# EAGLE design FioSaber Prototype B (EAGLE 6.5.0)
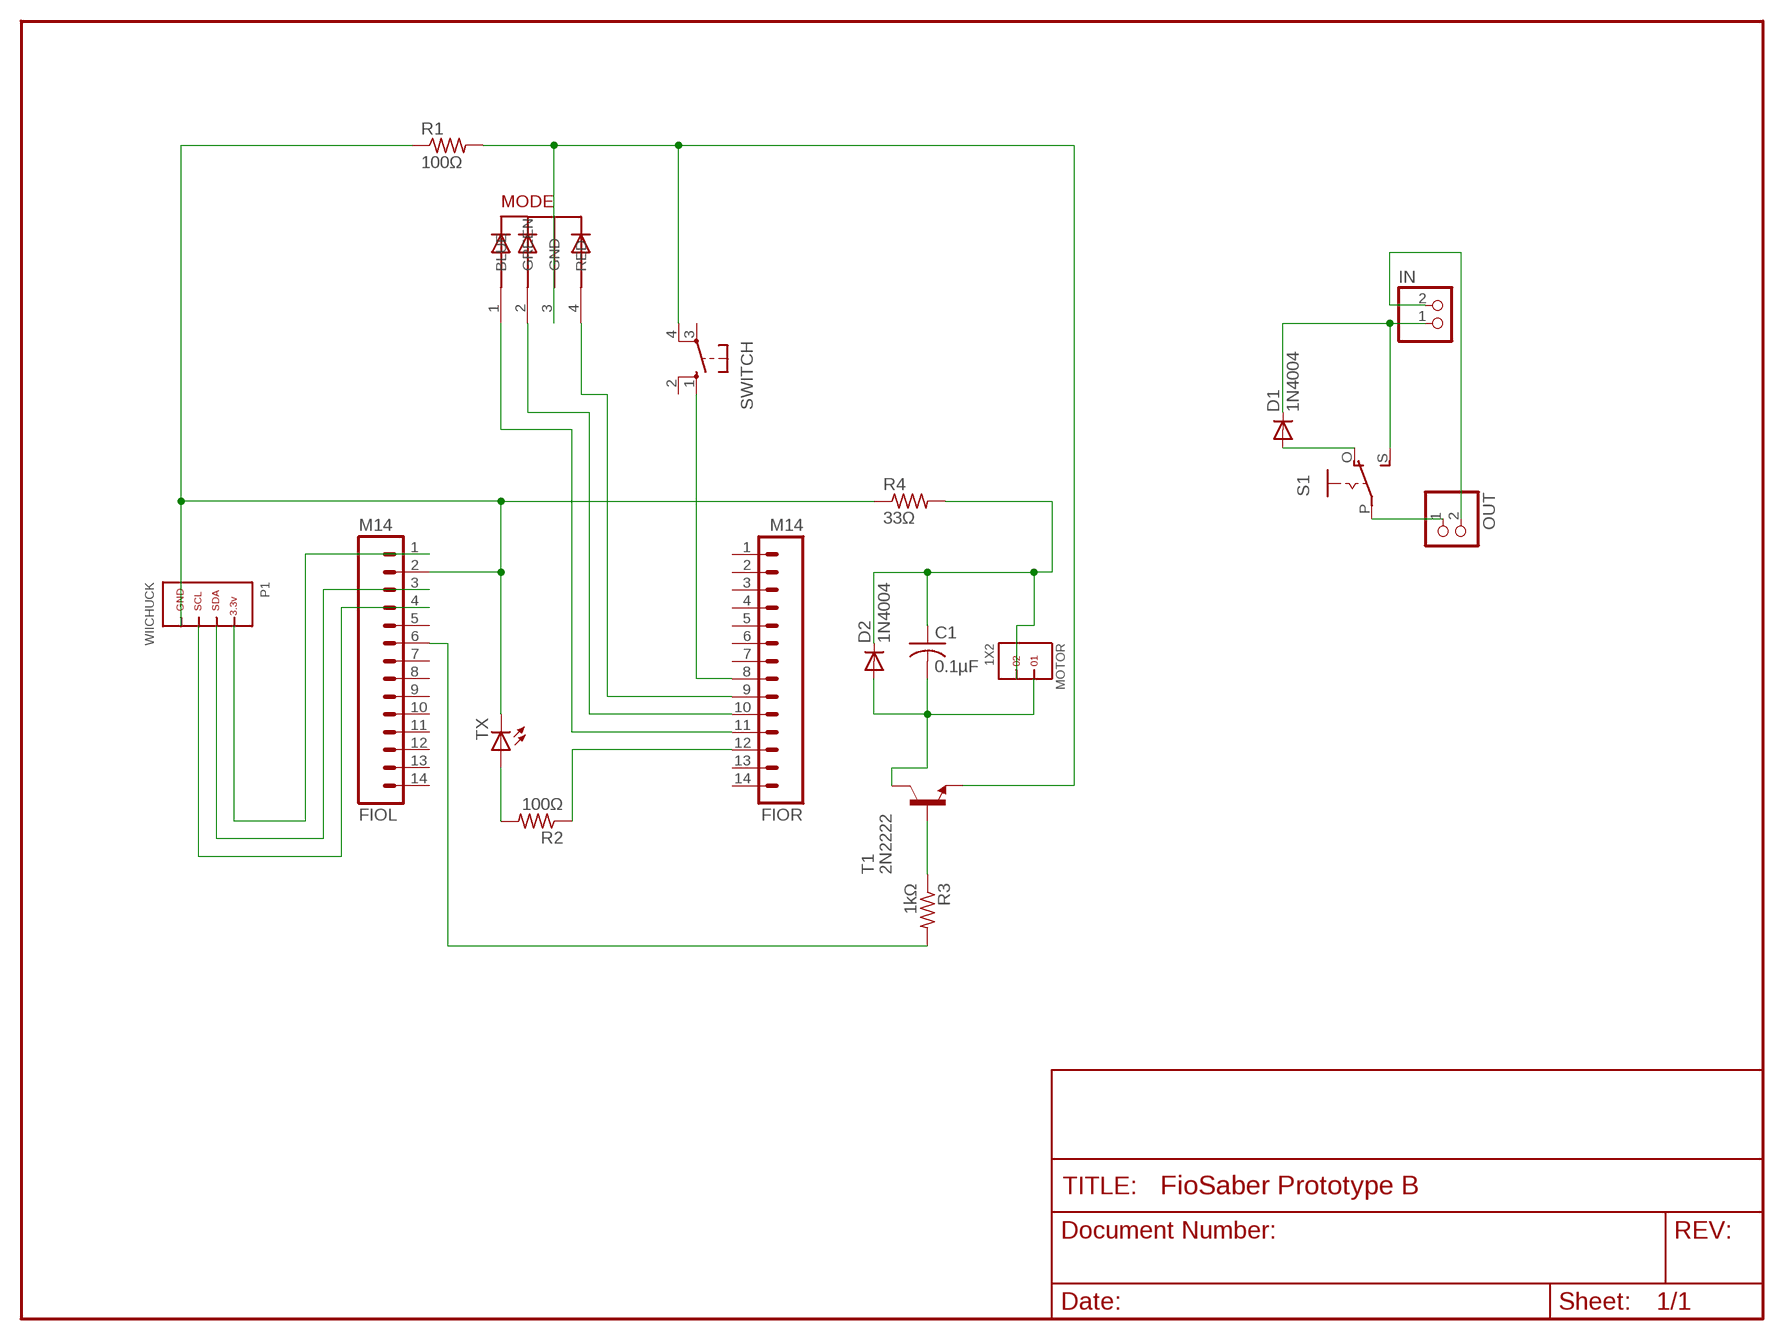
[diagram p0: schematic, sheet 1]

## Parts
C1  0.1µF  C-US025-025X050  [C025-025X050]
D1  1N4004  [DO41-10]
D2  1N4004  [DO41-10]
FIOL  M14  [1X14]
FIOR  M14  [1X14]
IN  JST_2PIN-SMT-RA  [JST-PH-2-SMT-RA]
MODE  5MMRGBLED  [LED5MMRGB]
MOTOR  1X2  [1X2]
OUT  JST_2PIN-SMT-RA  [JST-PH-2-SMT-RA]
P1  WIICHUCK  [MEMOREX_RECEIVER]
R1  100Ω  R-US_0207/7  [0207/7]
R2  100Ω  R-US_0207/7  [0207/7]
R3  1kΩ  R-US_0207/7  [0207/7]
R4  33Ω  R-US_0207/7  [0207/7]
S1  EG1218S  [EG1218]
SWITCH  10-XX  [B3F-10XX]
T1  2N2222  [TO92-EBC-OVAL]
TX  LED3MM  [LED3MM]

## Nets
N$1: FIOL.1 P1.PWR
N$2: D1.C IN.1 S1.S
N$3: FIOL.3 P1.SDA
N$4: FIOL.4 P1.SCL
N$5: D1.A S1.O
N$6: FIOR.11 MODE.1(BLUE)
N$7: FIOR.10 MODE.2(GREEN)
N$8: FIOR.9 MODE.4(RED)
N$9: FIOL.2 P1.GND R1.1 R4.1 TX.K(C)
N$10: OUT.1 S1.P
N$11: IN.2 OUT.2
N$13: MODE.3(GND) R1.2 SWITCH.4(P1) T1.E
N$14: FIOR.8 SWITCH.1(S)
N$16: FIOL.6 R3.2
N$17: FIOR.12 R2.1
N$18: R3.1 T1.B
N$19: C1.2 D2.A MOTOR.1 T1.C
N$20: C1.1 D2.C MOTOR.2 R4.2
N$25: R2.2 TX.A
Unconnected: FIOL.5 FIOL.7 FIOL.8 FIOL.9 FIOL.10 FIOL.11 FIOL.12 FIOL.13 FIOL.14 FIOR.1 FIOR.2 FIOR.3 FIOR.4 FIOR.5 FIOR.6 FIOR.7 FIOR.13 FIOR.14 SWITCH.2(S1) SWITCH.3(P)

## Library data of the parts
C1 = rcl:C-US: CAPACITOR, American symbol
D1 D2 = adafruit:1N4004: DIODE General purpose 1N400x type rectifier (With bigger pads) http://www.ladyada.net/library/pcb/eaglelibrary.html
FIOL FIOR = SparkFun:M14: Header 14 Standard 14-pin 0.1" header. Use with straight break away headers (SKU : PRT-00116), right angle break away headers (PRT-00553), swiss pins (PRT-00743), machine pins (PRT-00117), and female headers (PRT-00115).
IN OUT = adafruit:JST_2PIN: JST 2-Pin Connectors of various flavors SMT-RA (S2B-PH-SM4) 4UConnector #17311 SMT (B2B-PH-SM4) THM-RA (S2B-PH) THM (B2B-PH)
MODE = adafruit:5MMRGBLED
MOTOR = headers(.1in):1X2
P1 = nintendo:WIICHUCK
R1-R4 = adafruit:R-US_: RESISTOR, American symbol
S1 = adafruit:EG1218: SLIDING SWITCH 0.1" spacing through hole, vertical SPDT slide switch http://www.ladyada.net/library/pcb/eaglelibrary.html
SWITCH = switch-omron:10-XX: OMRON SWITCH; MPN: B3F-1000; OC_FARNELL: 176432; OC_NEWARK: 36M3542
T1 = adafruit:2N2222: NPN TRANSISTOR Big oval pads
TX = adafruit:LED: LED OSRAM: - CHIPLED LG R971, LG N971, LY N971, LG Q971, LY Q971, LO R971, LY R971 LH N974, LH R974 LS Q976, LO Q976, LY Q976 LO Q996 - Hyper CHIPLED LW Q18S LB Q993, LB Q99A, LB R99A - SideLED LS A670, LO A670, LY A670, LG A670, LP A670 LB A673, LV A673, LT A673, LW A673 LH A674 LY A675 LS A676, LA A676, LO A676, LY A676, LW A676 LS A679, LY A679, LG A679 - Hyper Micro SIDELED® LS Y876, LA Y876, LO Y876, LY Y876 LT Y87S - SmartLED LW L88C, LW L88S LB L89C, LB L89S, LG L890 LS L89K, LO L89K, LY L89K LS L896, LA L896, LO L896, LY L896 - TOPLED LS T670, LO T670, LY T670, LG T670, LP T670 LSG T670, LSP T670, LSY T670, LOP T670, LYG T670 LG T671, LOG T671, LSG T671 LB T673, LV T673, LT T673, LW T673 LH T674 LS T676, LA T676, LO T676, LY T676, LB T676, LH T676, LSB T676, LW T676 LB T67C, LV T67C, LT T67C, LS T67K, LO T67K, LY T67K, LW E67C LS E67B, LA E67B, LO E67B, LY E67B, LB E67C, LV E67C, LT E67C LW T67C LS T679, LY T679, LG T679 LS T770, LO T770, LY T770, LG T770, LP T770 LB T773, LV T773, LT T773, LW T773 LH T774 LS E675, LA E675, LY E675, LS T675 LS T776, LA T776, LO T776, LY T776, LB T776 LHGB T686 LT T68C, LB T68C - Hyper Mini TOPLED® LB M676 - Mini TOPLED Santana® LG M470 LS M47K, LO M47K, LY M47K Source: http://www.osram.convergy.de/

## Net classes
0 Default: width 0.203 mm, clearance 0.205 mm
2 LEDPower: width 0.203 mm
3 ButtonSignal: width 0.203 mm

## Board
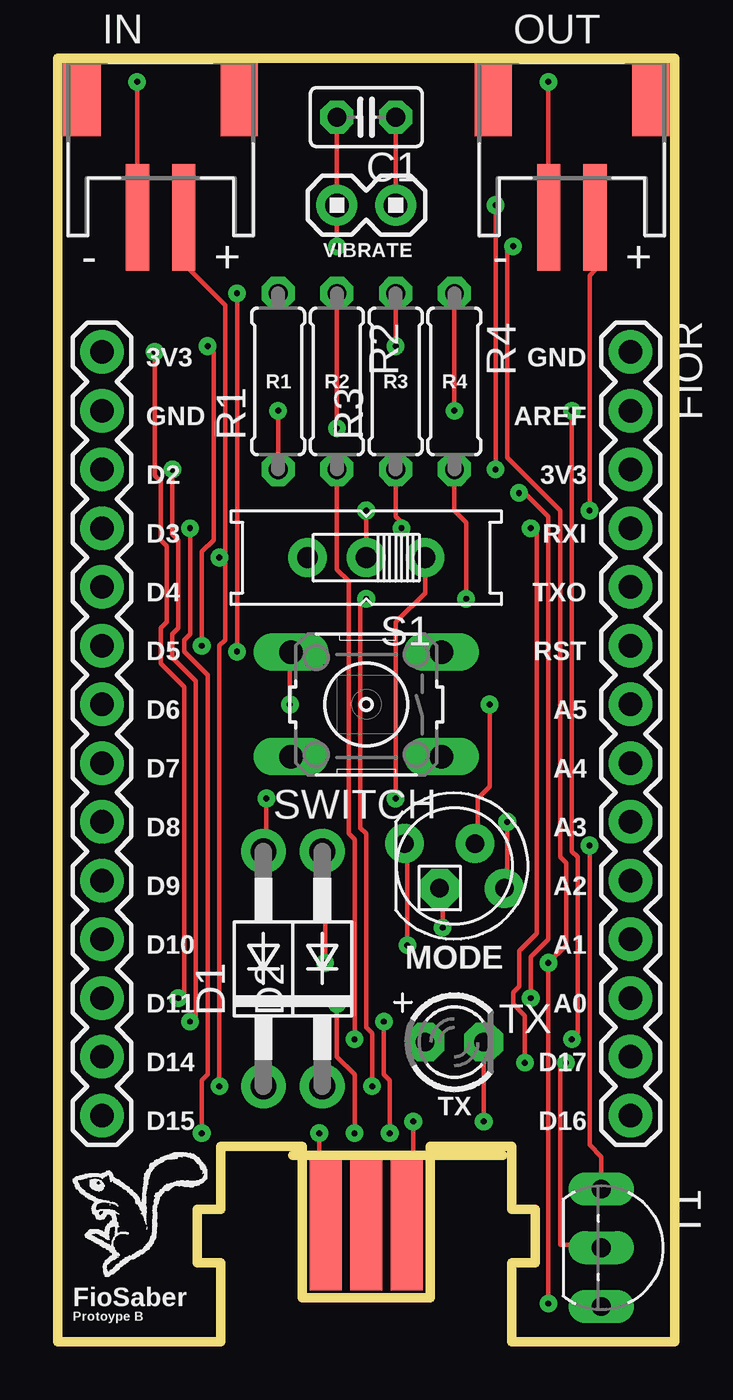
[diagram p1: board, top side]
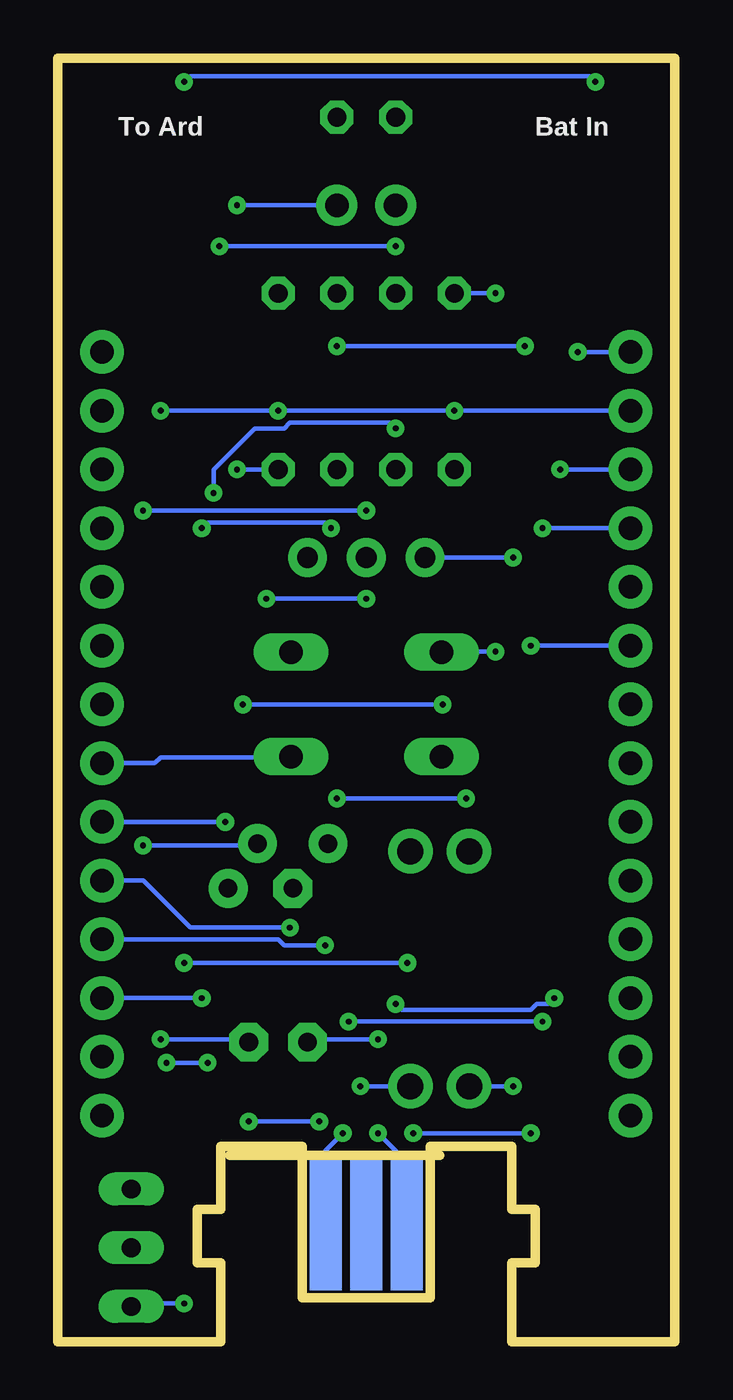
[diagram p2: board, bottom side, seen from below]

Size 26.67 x 55.5 mm. Coordinates in mm from the lower left corner, seen from the top.
Outline: 0,0 7.04,0 7.04,3.4 6.02,3.4 6.02,5.71 7.04,5.71 7.04,8.46 10.57,8.46 10.57,1.91 16.1,1.91 16.1,8.46 19.63,8.46 19.63,5.71 20.65,5.71 20.65,3.4 19.63,3.4 19.63,0 26.67,0 26.67,55.5 0,55.5 0,0
Copper layers (1*16): Top 0.035mm / dielectric 1.5mm / Bottom 0.035mm
Design rules "SparkFun *": minimum track width 8mil, minimum drill 10mil, track to track 7mil, track to pad 7mil, pad to pad 7mil, via to via 7mil, smd to smd 7mil, copper to edge 10mil, drill to drill 8mil, minimum pad ring 12mil, minimum via ring 10mil, stop-mask expansion 4mil, vias tented up to drill 20mil, thermal gap 10mil
Milling: area 10.2,8.1 to 19.2,8.1

### Footprints (pad centres in the part's own frame; a part is rotated, then mirrored left to right if it is on the bottom)
C025-025X050 = drill 0.813 octagon: 1 -1.27,0; 2 1.27,0
DO41-10 = drill 1.118 pad 1.93: A 5.08,0; C -5.08,0
1X14 = drill 1.016 pad 1.88: 1 0,0; 2 2.54,0; 3 5.08,0; 4 7.62,0; 5 10.16,0; 6 12.7,0; 7 15.24,0; 8 17.78,0; 9 20.32,0; 10 22.86,0; 11 25.4,0; 12 27.94,0; 13 30.48,0; 14 33.02,0
JST-PH-2-SMT-RA = smd 1 x 4.6: 1 1,-3.7; 2 -1,-3.7 | smd 1.6 x 3.4: NC1 -3.4,1.5; NC2 3.4,1.5
LED5MMRGB = drill 0.8 pad 1.676: 1 -2.159,0.968; 3 0.889,0.968; 4 2.159,-0.968 | drill 0.8 pad 1.676 octagon: 2 -0.635,-0.968
1X2 = drill 1.016 pad 1.778: 1 0,0; 2 2.54,0
MEMOREX_RECEIVER = smd 1.4 x 6 bottom: ATT 0,5.6; PWR -1.75,5.6; SDA 1.75,5.6 | smd 1.4 x 6: GND 1.75,5.6; NC 0,5.6; SCL -1.75,5.6
0207/7 = drill 0.813 octagon: 1 -3.81,0; 2 3.81,0
EG1218 = drill 0.9 pad 1.676: O -2.54,0; P 0,0; S 2.54,0
B3F-10XX = drill 1.016 long: 1 -3.251,2.261; 2 3.251,2.261; 3 -3.251,-2.261; 4 3.251,-2.261
TO92-EBC-OVAL = drill 0.813 long: B 0,-1.27; C 2.54,-1.27; E -2.54,-1.27
LED3MM = drill 0.813 pad 1.676 octagon: A -1.27,0; K 1.27,0

### Placement (x,y rotation side)
C1  13.33,52.96 180 top
D1  8.89,16.13 90 top
D2  11.43,16.13 90 top
FIOL  1.91,42.8 270 top
FIOR  24.77,42.8 270 top
IN  4.45,52.32 0 top
MODE  17.15,20.57 0 top
MOTOR  12.06,49.15 0 top
OUT  22.23,52.32 0 top
P1  13.33,-0.38 0 top
R1  9.53,41.53 90 top
R2  12.06,41.53 270 top
R3  14.61,41.53 90 top
R4  17.15,41.53 270 top
S1  13.33,33.91 180 top
SWITCH  13.33,27.56 180 top
T1  24.77,4.06 270 top
TX  17.15,12.95 0 top

### Tracks (layer width: path | path; a pad name or v marks a point on that pad's centre or on a via)
N$1  (via drill 0.25)
  Top 0.203: v4.19,42.8 4.19,37.46 4.45,37.21 4.45,34.67 4.7,34.42 4.7,31.11 4.45,30.86 4.45,29.34 5.46,28.32 5.46,15.11 v5.21,14.86 | v12.06,14.61 12.06,12.32 12.83,11.56 v12.83,9.02
  Bottom 0.203: v4.19,42.8 FIOL.1 | v5.21,14.86 5.46,14.61 5.97,14.61 6.22,14.35 11.81,14.35 v12.06,14.61 | v12.83,9.02 11.56,7.75 11.56,5.46 P1.PWR
N$2  (via drill 0.25)
  Top 0.203: 7.24,34.16 7.24,44.83 5.46,46.61 5.46,48.39 IN.1 | v6.98,11.05 6.98,30.1 7.24,30.35 7.24,34.16 | 7.24,34.16 v6.98,33.91
  Bottom 0.203: v6.98,33.91 S1.S | v6.98,11.05 D1.C
N$3  (via drill 0.25)
  Top 0.203: v4.95,37.72 4.95,34.92 5.21,34.67 5.21,30.86 4.95,30.61 4.95,29.59 5.97,28.57 5.97,14.1 v5.71,13.84 | v14.1,13.84 14.1,11.56 14.35,11.3 v14.35,9.02
  Bottom 0.203: v4.95,37.72 FIOL.3 | v14.1,13.84 v5.71,13.84 | v14.35,9.02 15.11,8.26 15.11,5.46 P1.SDA
N$4  (via drill 0.25)
  Top 0.203: v5.71,35.18 5.71,30.61 5.46,30.35 5.46,29.84 6.48,28.83 6.48,11.56 6.22,11.3 v6.22,9.02 | v11.3,9.02 11.3,5.97 11.56,5.71 11.56,5.46 P1.SCL
  Bottom 0.203: v5.71,35.18 FIOL.4 | v11.3,9.02 v6.22,9.02
N$5  (via drill 0.25)
  Top 0.203: S1.O 15.88,32.38 14.61,31.11 v14.61,23.5 | v9.02,23.5 9.02,21.21 D1.A
  Bottom 0.203: v9.02,23.5 v14.61,23.5
N$6  (via drill 0.25)
  Top 0.203: v15.11,17.14 15.11,21.46 MODE.1
  Bottom 0.203: v15.11,17.14 16.89,17.14 17.15,17.4 FIOR.11
N$7  (via drill 0.25)
  Top 0.203: v16.64,17.91 16.64,19.43 MODE.2
  Bottom 0.203: v16.64,17.91 20.96,17.91 22.99,19.94 FIOR.10
N$8  (via drill 0.25)
  Top 0.203: v19.43,22.48 19.43,19.68 MODE.4
  Bottom 0.203: FIOR.9 v19.43,22.48
N$9  (via drill 0.25)
  Top 0.203: v18.42,9.53 TX.K | v15.37,9.53 15.37,5.97 15.11,5.71 15.11,5.46 P1.GND | v9.53,40.26 R1.1 | v17.15,40.26 R4.1 | v22.23,13.08 22.48,13.34 22.48,20.96 22.23,21.21 v22.23,40.26
  Bottom 0.203: v15.37,9.53 v18.42,9.53 | FIOL.2 v9.53,40.26 v17.15,40.26 v22.23,40.26 | v22.23,13.08 18.42,13.08 TX.K
N$10  (via drill 0.25)
  Top 0.203: v13.33,35.94 S1.P | v22.99,35.94 22.99,46.1 23.24,46.35 23.24,48.39 OUT.1
  Bottom 0.203: v22.99,35.94 v13.33,35.94
N$11  (via drill 0.25)
  Top 0.203: v3.43,54.48 3.43,48.64 IN.2 | v21.21,54.48 21.21,48.64 OUT.2
  Bottom 0.203: v3.43,54.48 3.68,54.74 20.96,54.74 v21.21,54.48
N$13  (via drill 0.25)
  Top 0.203: v7.75,29.84 v7.75,45.34 | T1.E 23.5,8 22.99,8.51 v22.99,21.46 | v10.03,27.56 10.03,29.59 SWITCH.4 | v18.67,27.56 18.67,24 18.16,23.5 18.16,21.72 MODE.3
  Bottom 0.203: v7.75,45.34 R1.2 | v7.75,29.84 10.03,29.84 SWITCH.4 | v22.99,21.46 18.16,21.46 MODE.3 | v18.67,27.56 v10.03,27.56
N$14
  Bottom 0.203: FIOR.8 22.48,25.02 22.23,25.27 16.64,25.27 SWITCH.1
N$16  (via drill 0.25)
  Top 0.203: v14.61,43.05 R3.2 | v6.48,43.05 6.73,42.8 6.73,34.67 6.22,34.16 v6.22,30.1
  Bottom 0.203: v6.48,43.05 v14.61,43.05 | FIOL.6 v6.22,30.1
N$17  (via drill 0.25)
  Top 0.203: v12.06,39.5 R2.1 | v19.94,36.7 20.19,36.7 21.21,35.69 21.21,17.4 20.45,16.64 v20.45,14.86
  Bottom 0.203: v12.06,39.5 12.32,39.75 16.64,39.75 16.89,39.5 18.16,39.5 19.94,37.72 v19.94,36.7 | FIOR.12 v20.45,14.86
N$18  (via drill 0.25)
  Top 0.203: v21.97,12.06 21.72,11.81 21.72,4.19 23.5,4.19 T1.B | v20.19,12.06 20.19,14.1 19.69,14.61 19.69,15.11 19.94,15.37 19.94,16.89 20.7,17.65 20.7,34.92 v20.45,35.18 | v14.86,35.18 14.86,35.43 14.61,35.69 R3.1
  Bottom 0.203: v20.19,12.06 v21.97,12.06 | v20.45,35.18 20.19,35.43 15.11,35.43 v14.86,35.18
N$19  (via drill 0.25)
  Top 0.203: C1.2 MOTOR.1 v12.06,47.37 | v21.21,1.65 v21.21,16.38 21.97,17.14 21.97,20.7 21.72,20.96 21.72,35.94 19.43,38.23 19.43,47.12 v19.69,47.37 | v11.56,16.38 11.56,21.21 D2.A
  Bottom 0.203: v21.21,1.65 23.5,1.65 T1.C | v11.56,16.38 v21.21,16.38 | v19.69,47.37 v12.06,47.37
N$20  (via drill 0.25)
  Top 0.203: MOTOR.2 C1.1 | v18.92,49.15 v18.92,37.72 | v13.59,11.05 13.59,13.34 13.33,13.59 13.33,21.97 13.08,22.23 13.08,31.88 v13.33,32.13 | v17.65,32.13 17.65,35.43 17.15,35.94 R4.2
  Bottom 0.203: v18.92,37.72 R4.2 | MOTOR.2 v18.92,49.15 | v13.59,11.05 D2.C | v17.65,32.13 v13.33,32.13
N$25  (via drill 0.25)
  Top 0.203: R2.2 12.06,33.4 12.57,32.89 12.57,21.97 12.83,21.72 v12.83,13.08
  Bottom 0.203: v12.83,13.08 15.88,13.08 TX.A

### Text on the board
tPlace: VIBRATE | 3V3 | GND | R1 | R2 | R3 | R4 | GND | AREF | D2 | 3V3 | D3 | RXI | D4 | TXO | D5 | RST | D6 | A5 | D7 | A4 | D8 | A3 | D9 | A2 | D10 | MODE | A1 | D11 | A0 | D14 | D17 | D15 | TX | D16 | FioSaber | Protoype B
bPlace: Bat In | To Ard